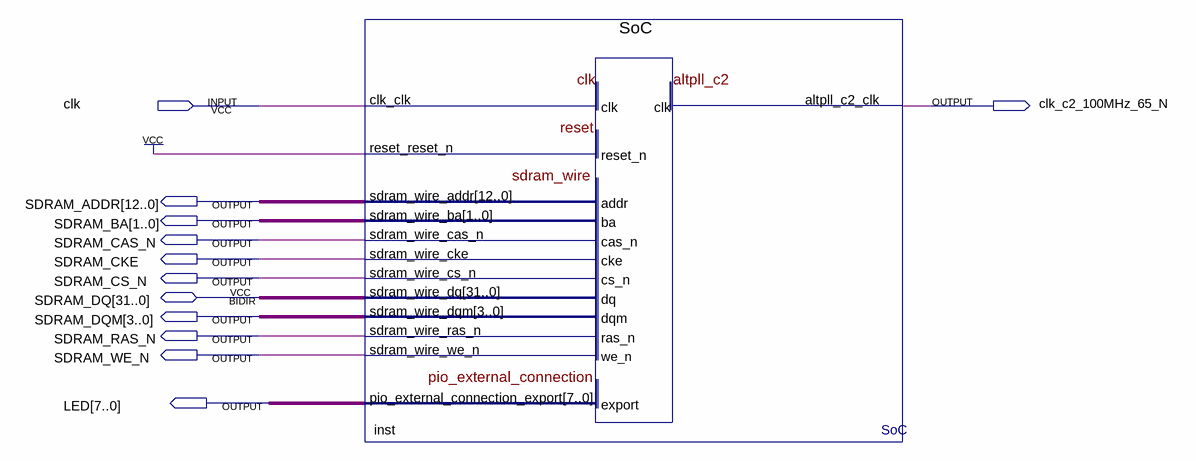
[diagram p0: schematic sheet]
// Quartus schematic TopLevel.bdf as structural Verilog: 1 symbols, 12 pins
module TopLevel (
  input  clk,
  inout  [31:0] SDRAM_DQ,
  output clk_c2_100MHz_65_N,
  output [12:0] SDRAM_ADDR,
  output [1:0] SDRAM_BA,
  output SDRAM_CAS_N,
  output SDRAM_CKE,
  output SDRAM_CS_N,
  output [3:0] SDRAM_DQM,
  output SDRAM_RAS_N,
  output SDRAM_WE_N,
  output [7:0] LED
);

  SoC inst (
    .clk_clk(clk), .reset_reset_n(1'b1), .altpll_c2_clk(clk_c2_100MHz_65_N), .sdram_wire_addr(SDRAM_ADDR),
    .sdram_wire_ba(SDRAM_BA), .sdram_wire_cas_n(SDRAM_CAS_N), .sdram_wire_cke(SDRAM_CKE),
    .sdram_wire_cs_n(SDRAM_CS_N), .sdram_wire_dqm(SDRAM_DQM), .sdram_wire_ras_n(SDRAM_RAS_N),
    .sdram_wire_we_n(SDRAM_WE_N), .pio_external_connection_export(LED), .sdram_wire_dq(SDRAM_DQ));
endmodule
